# Altium schematic sheet Modulo_de_apertura_perifericos.SchDoc
size A4; SheetNumber: 3; SheetTotal: 4
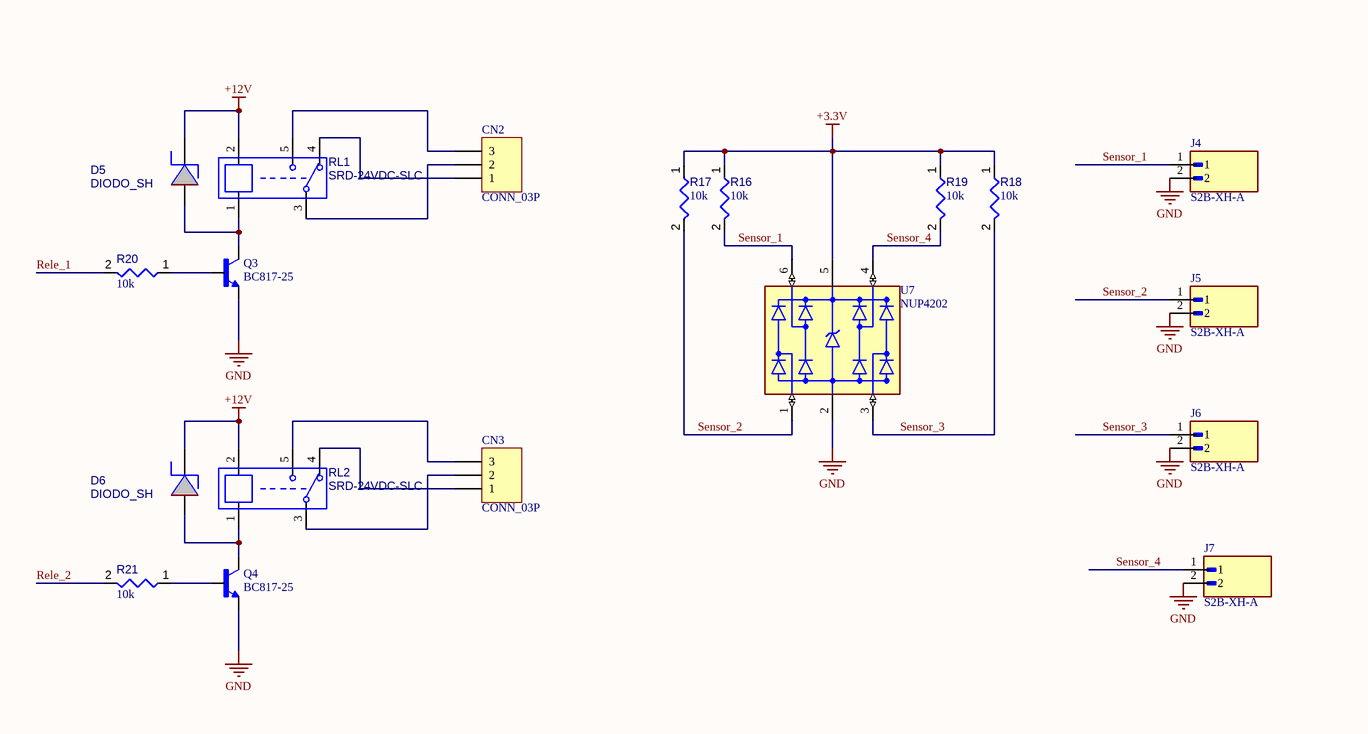
[diagram p0: Modulo_de_apertura_perifericos.SchDoc, left]
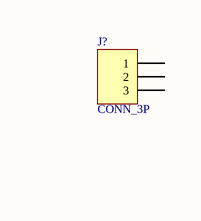
[diagram p1: Modulo_de_apertura_perifericos.SchDoc, right]

## Parts
CN2  CONN_03P  [TerminalBlock_1x3_P5mm]
CN3  CONN_03P  [TerminalBlock_1x3_P5mm]
D5  DIODO_SH  [D_SMA]
D6  DIODO_SH  [D_SMA]
J4  S2B-XH-A  [JST_S2B-XH-A]
J5  S2B-XH-A  [JST_S2B-XH-A]
J6  S2B-XH-A  [JST_S2B-XH-A]
J7  S2B-XH-A  [JST_S2B-XH-A]
J?  CONN_3P  [BORNERA_3P_P_5mm]
Q3  BC817-25  [SOT95P240X120-3N]
Q4  BC817-25  [SOT95P240X120-3N]
R16  value 10k  [RESC0402(1005)_L]  (hidden comment: Resistor 10K  +/-1 % 0402 63 mW)
R17  value 10k  [RESC0402(1005)_L]  (hidden comment: Resistor 10K  +/-1 % 0402 63 mW)
R18  value 10k  [RESC0402(1005)_L]  (hidden comment: Resistor 10K  +/-1 % 0402 63 mW)
R19  value 10k  [RESC0402(1005)_L]  (hidden comment: Resistor 10K  +/-1 % 0402 63 mW)
R20  value 10k  [RESC0402(1005)_L]  (hidden comment: Resistor 10K  +/-1 % 0402 63 mW)
R21  value 10k  [RESC0402(1005)_L]  (hidden comment: Resistor 10K  +/-1 % 0402 63 mW)
RL1  SRD-24VDC-SLC  [943-1C]
RL2  SRD-24VDC-SLC  [943-1C]
U7  NUP4202  [SOT65P210X100-6N]

## Nets
+3.3V: R16.1 R17.1 R18.1 R19.1 U7.5(VDD)
+12V: D5.2(K) D6.2(K) RL1.2 RL2.2
GND: J4.2 J5.2 J6.2 J7.2 Q3.2(E) Q4.2(E) U7.2(GND)
Rele_1: R20.2
Rele_2: R21.2
Sensor_1: J4.1 R16.2 U7.6(IO4)
Sensor_2: J5.1 R17.2 U7.1(IO1)
Sensor_3: J6.1 R18.2 U7.3(IO2)
Sensor_4: J7.1 R19.2 U7.4(IO3)
NetCN2_1: CN2.1 RL1.4
NetCN2_2: CN2.2 RL1.3
NetCN2_3: CN2.3 RL1.5
NetCN3_1: CN3.1 RL2.4
NetCN3_2: CN3.2 RL2.3
NetCN3_3: CN3.3 RL2.5
NetD5_1: D5.1(A) Q3.3(C) RL1.1
NetD6_1: D6.1(A) Q4.3(C) RL2.1
NetQ3_1: Q3.1(B) R20.1
NetQ4_1: Q4.1(B) R21.1

Not connected (* = marked no-connect by the designer): J? 1 2 3

## Library data of the parts
CN2 CN3 = CONN_03P: Connector Generic 3 Vias
D5 D6 = DIODO_SH: Diode Shottky
Q3 Q4 = BC817-25: BJT, SOT-23, 45V, 800mA, NPN, 0.31W, 150Â°C; MF: Diotec Semiconductor; SnapEDA_Link: https://www.snapeda.com/parts/BC817-25/Diotec/view-part/?ref=snap; Package: SOT-23 Diotec; Value: *; MP: BC817-25; Check_prices: https://www.snapeda.com/parts/BC817-25/Diotec/view-part/?ref=eda
R16-R21 = CMP-009-00149-3: Chip Resistor, 10 kOhms, +/-1 %, 63 mW, -55 to 125 degC, 0402; Power: 63mW; Tolerance: 1%; Min Operating Temperature: -55°C; Case/Package: 0402; Max Operating Temperature: 155°C; Pins: 2
RL1 RL2 = RELAY SPDT
U7 = TESD5V0V4UCU6_RFG: SOT-363, 5V, 150W, 3pF, ESD Protection; MF: Taiwan Semiconductor; MP: TESD5V0V4UCU6 RFG; SnapEDA_Link: https://www.snapeda.com/parts/TESD5V0V4UCU6%20RFG/Taiwan+Semiconductor/view-part/?ref=snap; Package: SOT-363 Taiwan Semiconductor; Value: *; Check_prices: https://www.snapeda.com/parts/TESD5V0V4UCU6%20RFG/Taiwan+Semiconductor/view-part/?ref=eda
J4-J7 = S2B-XH-A: Package: None; Price: None; Value: *; MP: S2B-XH-A; Availability: Unavailable